# Altium schematic sheet Topsheet.SchDoc
size A
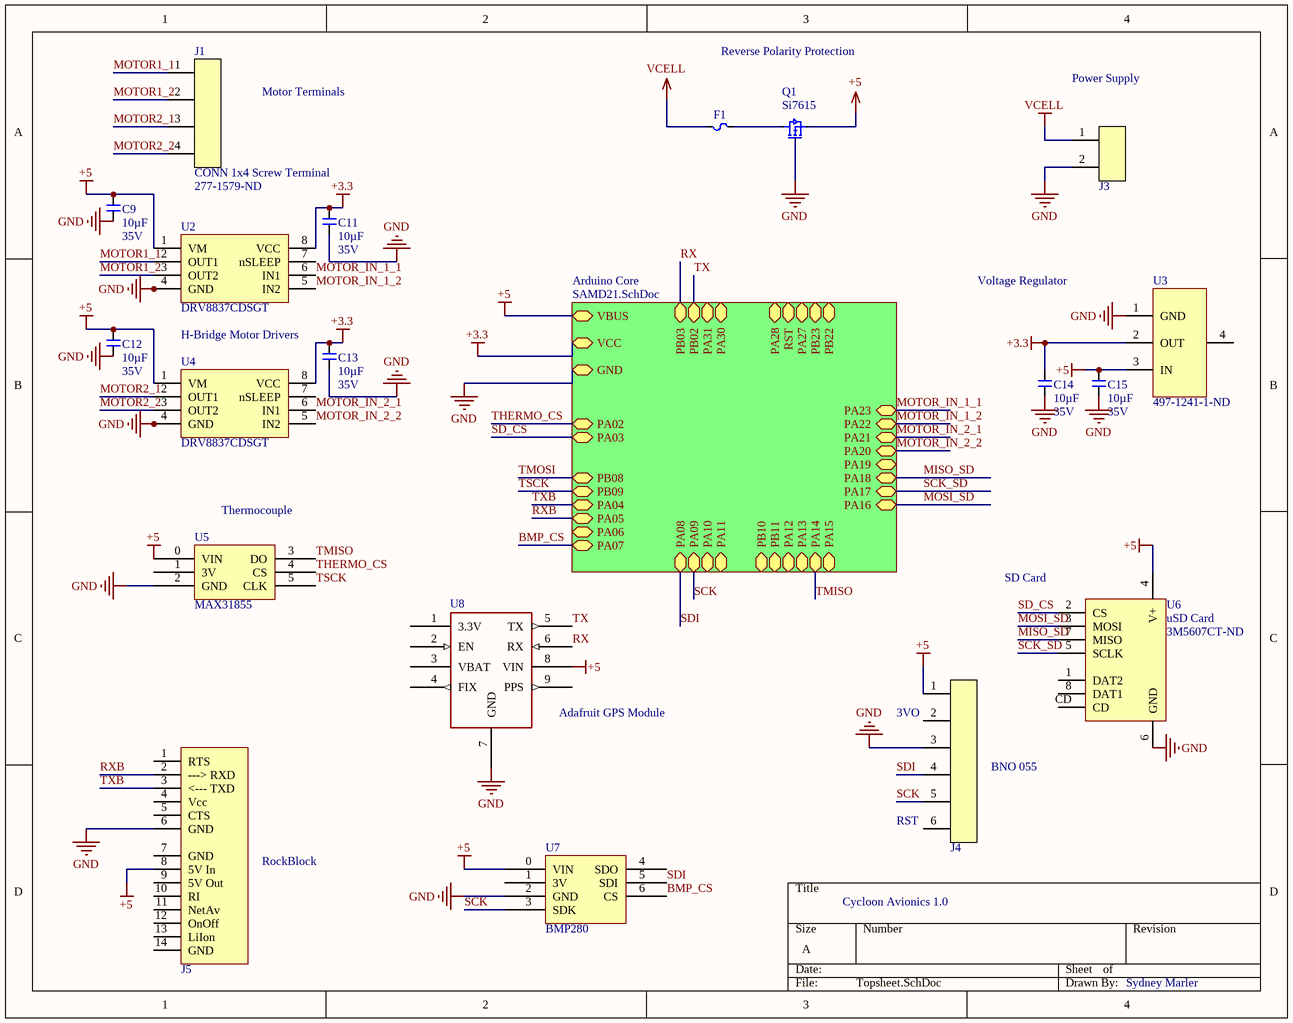
[diagram p0: Topsheet.SchDoc]

## Parts
C9  Capacitance (shorthand): 10µF  Rated Voltage: 35V  [C0603]  (hidden comment: __template_cap)
C11  Capacitance (shorthand): 10µF  Rated Voltage: 35V  [C0603]  (hidden comment: __template_cap)
C12  Capacitance (shorthand): 10µF  Rated Voltage: 35V  [C0603]  (hidden comment: __template_cap)
C13  Capacitance (shorthand): 10µF  Rated Voltage: 35V  [C0603]  (hidden comment: __template_cap)
C14  Capacitance (shorthand): 10µF  Rated Voltage: 35V  [C0603]  (hidden comment: __template_cap)
C15  Capacitance (shorthand): 10µF  Rated Voltage: 35V  [C0603]  (hidden comment: __template_cap)
F1  __template_fuse  (value not drawn)
J1  CONN 1x4 Screw Terminal  Supplier Part Number 1: 277-1579-ND  [CONN_1x4_5mm]
J3  CONN HEADER 2POS VERT T/H  [CONN_1x2_100MIL]  (value not drawn)
J4  CONN HEADER 6POS T/H  [CONN_1x6_100MIL]  (value not drawn)
J5  ROCKBLOCK_V2  [ROCKBLOCK_V2]  (value not drawn)
Q1  Si7615  [POWERPAK_1212-8_SINGLE]
U2  DRV8837CDSGT  [8WSON]
U3  Supplier Part Number 1: 497-1241-1-ND  [4SOT223]  (hidden comment: LDO_LD1117S33CTR)
U4  DRV8837CDSGT  [8WSON]
U5  MAX31855  [ADAFRUIT_THERMOCOUPLE_BREAKOUT]
U6  uSD Card  Supplier Part Number 1: 3M5607CT-ND  [MICROSD_CARD_SOCKET]
U7  BMP280  [ADAFRUIT_BMP280_BREAKOUT]
U8  Adafruit GPS Module  [adafruit_gps_746]

## Sub-sheets
Arduino Core = SAMD21.SchDoc: PB10 (bidir), PA15 (bidir), PA12 (bidir), GND (bidir), RST (bidir), PA28 (bidir), PA08 (bidir), PA09 (bidir), PA10 (bidir), VCC (bidir), PA11 (bidir), PB11 (bidir), PA13 (bidir), PA14 (bidir), PA02 (bidir), PA03 (bidir), PB08 (bidir), PB09 (bidir), PA04 (bidir), PA05 (bidir), PA06 (bidir), PA07 (bidir), PA17 (bidir), PA18 (bidir), PA19 (bidir), PA20 (bidir), PA21 (bidir), PA22 (bidir), PA23 (bidir), PA30 (bidir), PB23 (bidir), PB22 (bidir), PA27 (bidir), PA31 (bidir), VBUS (bidir), PB03 (bidir), PB02 (bidir), PA16 (bidir)

## Nets
+3.3: C11.1 C13.1 C14.1 U2.8(VCC) U3.2(OUT) U4.8(VCC) ; sheet Arduino Core/VCC
+5: C9.1 C12.1 C15.1 J4.1 J5.8(5V_In) Q1.2 U2.1(VM) U3.3(IN) U4.1(VM) U5.0(VIN) U6.4(V+) U7.0(VIN) U8.8(VIN) ; sheet Arduino Core/VBUS
GND: C9.2 C11.2 C12.2 C13.2 C14.2 C15.2 J3.2 J4.3 J5.6(GND) Q1.1 U2.4(GND) U2.PAD U3.1(GND) U4.4(GND) U4.PAD U5.2(GND) U6.6(GND) U7.2(GND) U8.7(GND) ; sheet Arduino Core/GND
VCELL: F1.1 J3.1
BMP_CS: U7.6(CS) ; sheet Arduino Core/PA07
MISO_SD: U6.7(MISO) ; sheet Arduino Core/PA18
MOSI_SD: U6.3(MOSI) ; sheet Arduino Core/PA16
MOTOR1_1: J1.1 U2.2(OUT1)
MOTOR1_2: J1.2 U2.3(OUT2)
MOTOR2_1: J1.3 U4.2(OUT1)
MOTOR2_2: J1.4 U4.3(OUT2)
MOTOR_IN_1_1: U2.6(IN1) ; sheet Arduino Core/PA23
MOTOR_IN_1_2: U2.5(IN2) ; sheet Arduino Core/PA22
MOTOR_IN_2_1: U4.6(IN1) ; sheet Arduino Core/PA21
MOTOR_IN_2_2: U4.5(IN2) ; sheet Arduino Core/PA20
RX: U8.6(RX) ; sheet Arduino Core/PB03
RXB: J5.2(--->_RXD) ; sheet Arduino Core/PA05
SCK: J4.5 U7.3(SDK) ; sheet Arduino Core/PA09
SCK_SD: U6.5(SCLK) ; sheet Arduino Core/PA17
SD_CS: U6.2(CS) ; sheet Arduino Core/PA03
SDI: J4.4 U7.5(SDI) ; sheet Arduino Core/PA08
THERMO_CS: U5.4(CS) ; sheet Arduino Core/PA02
TMISO: U5.3(DO) ; sheet Arduino Core/PA14
TMOSI: sheet Arduino Core/PB08
TSCK: U5.5(CLK) ; sheet Arduino Core/PB09
TX: U8.5(TX) ; sheet Arduino Core/PB02
TXB: J5.3(<---_TXD) ; sheet Arduino Core/PA04
NetF1_2: F1.2 Q1.3

Not connected (* = marked no-connect by the designer): J4 2 6; J5 1(RTS) 4(Vcc) 5(CTS) 7(GND) 9(5V_Out) 10(RI) 11(NetAv) 12(OnOff) 13(LiIon) 14(GND); U2 7(nSLEEP); U3 4(GND); U4 7(nSLEEP); U5 1(3V); U6 1(DAT2) 8(DAT1) CD; U7 1(3V) 4(SDO); U8 1(3.3V) 2(EN) 3(VBAT) 4(FIX) 9(PPS)

## Notes on the sheet
- Motor Terminals
- Reverse Polarity Protection
- Power Supply
- Voltage Regulator
- (near C13) H-Bridge Motor Drivers
- (near U5) Thermocouple
- (near U6) SD Card
- (near J4) 3VO
- (near J4) BNO 055
- (near J4) RST
- RockBlock
- Cycloon Avionics 1.0
- Sydney Marler

## Library data of the parts
C9 C11-C15 = 490-13248-1-ND: CAP CER 10UF 35V X5R 0603 20%; Manufacturer: Murata Electronics North America; Capacitance - pF (Machine readable): #NAME?; type: capacitor; Supplier Part Number 1: 490-13248-1-ND; Dielectric: X5R; Supplier 1: Digikey
J1 = CONN_1x4_PhoenixContact_1935187: CONN 1x4 Screw Terminal: Phoenix Contact 1935187; ComponentLink1Description: Digikey part; ComponentLink1URL: https://www.digikey.com/product-detail/en/phoenix-contact/1935187/277-1579-ND/568616; Supplier 1: Digi-Key
J3 = CONN_1x2: Manufacturer: FCI; Manufacturer Part Number: 77311-118-02LF; Connector Type: Header, Unshrouded; Number of Positions: 2; Number of Positions Loaded: All; Pitch: 0.100" (2.54mm); RoHS: RoHS Compliant; Category: Connectors, Interconnects; Packaging: Bulk; Contact Type: Male Pin; Number of Rows: 1; Mounting Type: Through Hole; Termination: Solder; Fastening Type: -; Features: -; ComponentLink1URL: http://portal.fciconnect.com/res/en/pdffiles/doc_search//77311.pdf; ComponentLink1Description: http://portal.fciconnect.com/res/en/pdffiles/doc_search//77311.pdf; Row Spacing: -; Contact Mating Length: 0.230" (5.84mm); Contact Finish: Gold, GXT™; Contact Finish Thickness: 30µin (0.76µm); Color: Black
J4 = CONN_1x6
J5 = ROCKBLOCK_V2: CHILD OF SATAN, SOURCE OF BOTH TREMENDOUS FORTUNE AND UNSPEAKABLE ANGUISH; ComponentLink1Description: Developer's Guide; ComponentLink1URL: https://www.rock7.com/downloads/RockBLOCK-Developer-Guide-Mk2.pdf
Q1 = PFET_SI7615ADN-T1: MOSFET P-CH 20V 35A PPK; pin to pad: 1>4 2>1 3>5; Manufacturer: Vishay Siliconix; Manufacturer Part Number: SI7615ADN-T1-GE3; FET Type: MOSFET P-Channel, Metal Oxide; FET Feature: Standard; Current - Continuous Drain (Id) @ 25°C: 35A (Tc); Rds On (Max) @ Id, Vgs: 4.4 mOhm @ 20A, 10V; Vgs(th) (Max) @ Id: 1.5V @ 250µA; Gate Charge (Qg) @ Vgs: 183nC @ 10V; Input Capacitance (Ciss) @ Vds: 5590pF @ 10V; Power - Max: 52W; Supplier 1: Digi-Key; Supplier Part Number 1: SI7615ADN-T1-GE3CT-ND; RoHS: RoHS Compliant; Category: Discrete Semiconductor Products; Stock 1: 98451; Pricing 1: 1=0.73, 10=0.646, 25=0.6068, 100=0.4951, 250=0.45988, 500=0.3914, 1000=0.31312 (USD); Packaging: Cut Tape (CT); Part Status: Active; Drain to Source Voltage (Vdss): 20V; Operating Temperature: -55°C ~ 150°C (TJ); Mounting Type: Surface Mount; Package / Case: PowerPAK® 1212-8; Supplier Device Package: PowerPAK® 1212-8; ComponentLink1URL: http://www.vishay.com/docs/62667/si7615adn.pdf; ComponentLink1Description: http://www.vishay.com/docs/62667/si7615adn.pdf
U2 U4 = MOTOR_HBRIDGE_DRV8837C: MOTOR DRIVER 1A; Manufacturer: Texas Instruments; Output Configuration: Half Bridge (2); Interface: PWM; Load Type: Inductive; Rds On (Typ): 1 Ohm LS + HS; Voltage - Supply: 1.8 V ~ 7 V; Voltage - Load: 0 V ~ 11 V; Fault Protection: Current Limiting, Over Temperature, Short Circuit, UVLO; Supplier 1: Digi-Key; Manufacturer Part Number: DRV8837CDSGT; RoHS: RoHS Compliant; Category: Integrated Circuits (ICs); Stock 1: 1424; Pricing 1: 1=1.28, 10=1.146, 100=0.8931 (USD); Packaging: Cut Tape (CT); Part Status: Active; Applications: DC Motors, Solenoids; Technology: NMOS; Current - Output / Channel: -; Current - Peak Output: 1A; Operating Temperature: -40°C ~ 150°C (TJ); Features: -; Mounting Type: Surface Mount; Package / Case: 8-WFDFN Exposed Pad; Supplier Device Package: 8-WSON (2x2); ComponentLink1URL: http://www.ti.com/lit/ds/symlink/drv8837c.pdf; ComponentLink1Description: http://www.ti.com/lit/ds/symlink/drv8837c.pdf; Supplier Part Number 1: 296-44747-1-ND
U3 = LDO_LD1117S33CTR: IC VOLTAGE REG 3.3V 800MA SOT223 INDUSTRIAL TEMP; Manufacturer: STMicroelectronics; Regulator Topology: Positive Fixed; Voltage - Dropout (Typical): 1.1V @ 800mA; Number of Regulators: 1; Voltage - Input: Up to 15V; Supplier 1: Digi-Key; Manufacturer Part Number: LD1117S33CTR; RoHS: RoHS Compliant; Category: Integrated Circuits (ICs); Stock 1: 63873; Pricing 1: 1=0.46, 10=0.373, 100=0.2538, 500=0.19034, 1000=0.14276 (USD); Packaging: Cut Tape (CT); Part Status: Active; Voltage - Output: 3.3V; Current - Output: 800mA; Current - Limit (Min): -; Operating Temperature: -40°C ~ 125°C; Mounting Type: Surface Mount; Package / Case: TO-261-4, TO-261AA; Supplier Device Package: SOT-223; ComponentLink1URL: http://www.st.com/content/ccc/resource/technical/document/datasheet/99/3b/7d/91/91/51/4b/be/CD00000544.pdf/files/CD00000544.pdf/jcr:content/translations/en.CD00000544.pdf; ComponentLink1Description: http://www.st.com/content/ccc/resource/technical/document/datasheet/99/3b/7d/91/91/51/4b/be/CD00000544.pdf/files/CD00000544.pdf/jcr:content/translations/en.CD00000544.pdf
U5 = ADAFRUIT_THERMOCOUPLE_BREAKOUT
U6 = MICRO_SD_CARD_HOLDER: MICROSD CARD HOLDER, PUSH-PUSH; pin to pad: 6>6+SHIELD1+SHIELD2+SHIELD3; Manufacturer: 3M; Manufacturer Part Number: 2908-05WB-MG; Card Type: Secure Digital - microSD™; Number of Positions: 10 (8 + 2); Connector Type: Connector and Ejector; Insertion, Removal Method: Push In, Push Out; Supplier 1: Digi-Key; RoHS: RoHS Compliant; Category: Connectors, Interconnects; Stock 1: 32313; Pricing 1: 1=3.6, 10=3.458, 25=3.1704, 50=3.0262, 100=2.882, 250=2.52176, 500=2.4497, 1000=2.08945 (USD); Packaging: Cut Tape (CT); Ejector Side: -; Mounting Type: Surface Mount, Right Angle; Features: Switch; Height Above Board: 0.073" (1.85mm); Mounting Feature: Normal, Standard - Top; Contact Finish: Gold; Contact Finish Thickness: 15µin (0.38µm); ComponentLink1URL: http://multimedia.3m.com/mws/media/416257O/3mtm-card-connector-microsdtm-2900-series-ts2197.pdf; ComponentLink1Description: http://multimedia.3m.com/mws/media/416257O/3mtm-card-connector-microsdtm-2900-series-ts2197.pdf
U7 = ADAFRUIT_BMP280_BREAKOUT
U8 = ADAFRUIT_GPS_746: https://www.adafruit.com/product/746; ComponentLink1Description: Adafruit GPS Module; ComponentLink1URL: https://www.adafruit.com/product/746